# EAGLE design PCB-BI8-2x1 (EAGLE 7.5.0)

## Sheet 1 of 2
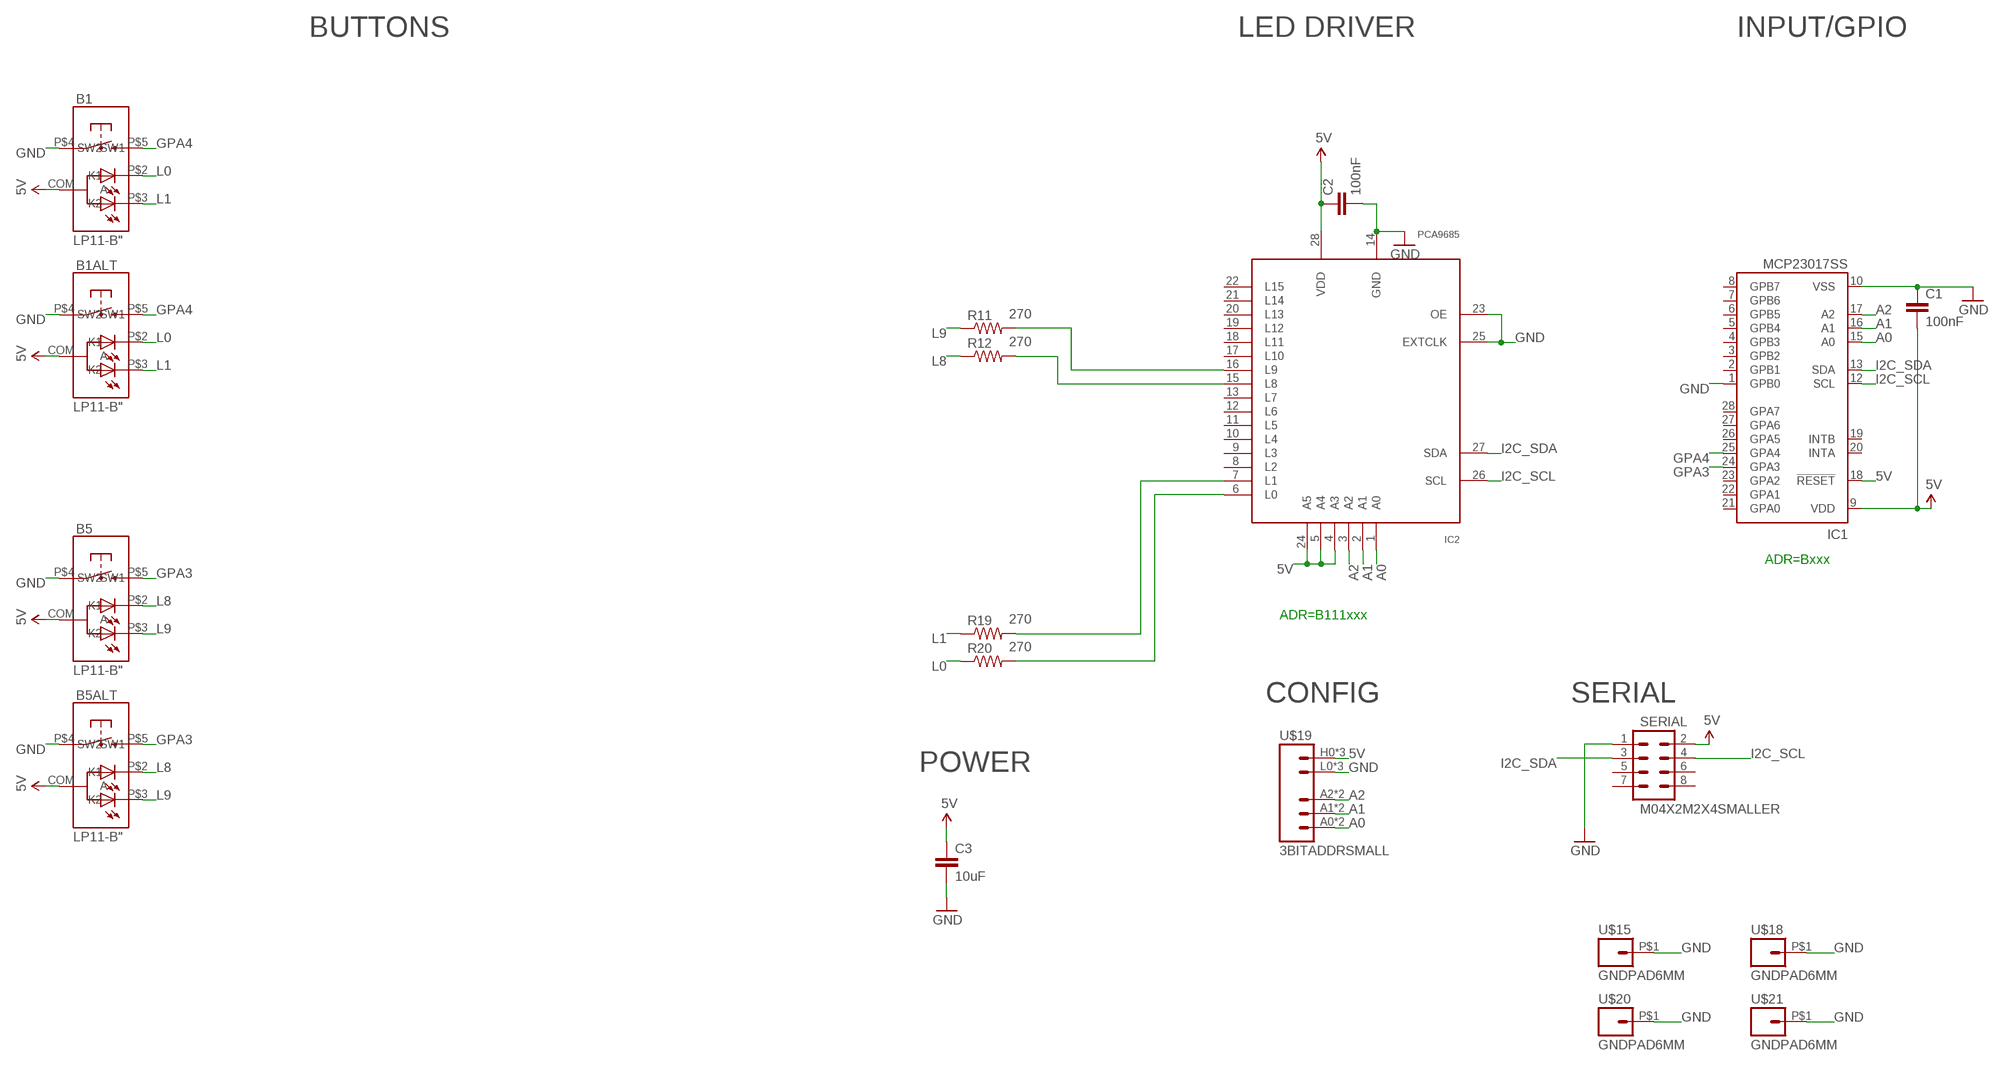
[diagram p0: schematic, sheet 1]

### Parts
B1  LP11-B"  [LP11]
B1ALT  LP11-B"  [LP11]
B5  LP11-B"  [LP11]
B5ALT  LP11-B"  [LP11]
C1  100nF  CAP0603-CAP  [0603-CAP]
C2  100nF  CAP0603-CAP  [0603-CAP]
C3  10uF  CAP0805  [0805]
IC1  MCP23017SS  [SSOP28]
IC2  PCA9685  [TSSOP28]
R11  270  RESISTOR0603-RES  [0603-RES]
R12  270  RESISTOR0603-RES  [0603-RES]
R19  270  RESISTOR0603-RES  [0603-RES]
R20  270  RESISTOR0603-RES  [0603-RES]
SERIAL  M04X2M2X4SMALLER  [M2X4SMALLER]
U$15  GNDPAD6MM  [3.2MMPAD6MM]
U$18  GNDPAD6MM  [3.2MMPAD6MM]
U$19  3BITADDRSMALL  [3BITADDR_SMALL]
U$20  GNDPAD6MM  [3.2MMPAD6MM]
U$21  GNDPAD6MM  [3.2MMPAD6MM]

### Nets
5V [Power]: B1.COM(A) B1ALT.COM(A) B5.COM(A) B5ALT.COM(A) C1.2 C2.1 C3.1 IC1.9(VDD) IC1.18(!RESET) IC2.4(A3) IC2.5(A4) IC2.24(A5) IC2.28(VDD) SERIAL.2 U$19.H0(VCC) U$19.H1(VCC) U$19.H2(VCC)
A0: IC1.15(A0) IC2.1(A0) U$19.A0 U$19.AS0(A0)
A1: IC1.16(A1) IC2.2(A1) U$19.A1 U$19.AS1(A1)
A2: IC1.17(A2) IC2.3(A2) U$19.A2 U$19.AS2(A2)
GND [Power]: B1.P$4(SW1) B1ALT.P$4(SW1) B5.P$4(SW1) B5ALT.P$4(SW1) C1.1 C2.2 C3.2 IC1.1(GPB0) IC1.10(VSS) IC2.14(GND) IC2.23(OE) IC2.25(EXTCLK) SERIAL.1 U$15.P$1 U$18.P$1 U$19.L0(GND) U$19.L1(GND) U$19.L2(GND) U$20.P$1 U$21.P$1
GPA3: B5.P$5(SW2) B5ALT.P$5(SW2) IC1.24(GPA3)
GPA4: B1.P$5(SW2) B1ALT.P$5(SW2) IC1.25(GPA4)
I2C_SCL: IC1.12(SCL) IC2.26(SCL) SERIAL.4
I2C_SDA: IC1.13(SDA) IC2.27(SDA) SERIAL.3
L0: B1.P$2(K1) B1ALT.P$2(K1) R20.1
L1: B1.P$3(K2) B1ALT.P$3(K2) R19.1
L8: B5.P$2(K1) B5ALT.P$2(K1) R12.1
L9: B5.P$3(K2) B5ALT.P$3(K2) R11.1
N$12: IC2.7(L1) R19.2
N$19: IC2.6(L0) R20.2
N$20: IC2.15(L8) R12.2
N$21: IC2.16(L9) R11.2
Unconnected: IC1.2(GPB1) IC1.3(GPB2) IC1.4(GPB3) IC1.5(GPB4) IC1.6(GPB5) IC1.7(GPB6) IC1.8(GPB7) IC1.19(INTB) IC1.20(INTA) IC1.21(GPA0) IC1.22(GPA1) IC1.23(GPA2) IC1.26(GPA5) IC1.27(GPA6) IC1.28(GPA7) IC2.8(L2) IC2.9(L3) IC2.10(L4) IC2.11(L5) IC2.12(L6) IC2.13(L7) IC2.17(L10) IC2.18(L11) IC2.19(L12) IC2.20(L13) IC2.21(L14) IC2.22(L15) SERIAL.5 SERIAL.6 SERIAL.7 SERIAL.8

### Notes on the sheet
- BUTTONS | LED DRIVER | INPUT/GPIO
- ADR=Bxxx
- ADR=B111xxx
- CONFIG | SERIAL
- POWER

## Sheet 2 of 2

## Library data of the parts
B1 B1ALT B5 B5ALT = SKAARHOJ:LP11-B
C1-C3 = SparkFun:CAP: Capacitor Standard 0603 ceramic capacitor, and 0.1" leaded capacitor.
IC1 = microchip:MCP23017: http://ww1.microchip.com/downloads/en/DeviceDoc/21952a.pdf Source: http://ww1.microchip.com/downloads/en/DeviceDoc/21952a.pdf; MF: MICROCHIP; MPN: MCP23017-E/SS; OC_FARNELL: 1467674; OC_NEWARK: 31K2960
IC2 = wsmith:PCA9685
R11 R12 R19 R20 = SparkFun:RESISTOR: Resistor Basic schematic elements and footprints for 0603, 1206, and PTH resistors.
SERIAL = SKAARHOJ:M04X2
U$15 U$18 U$20 U$21 = SKAARHOJ:GNDPAD
U$19 = SKAARHOJ:3BITADDR

## Net classes
0 default: width 0.203 mm, drill 0.406 mm, clearance 0.203 mm
1 Power: width 0.406 mm, drill 0.61 mm, clearance 0.203 mm

## Board
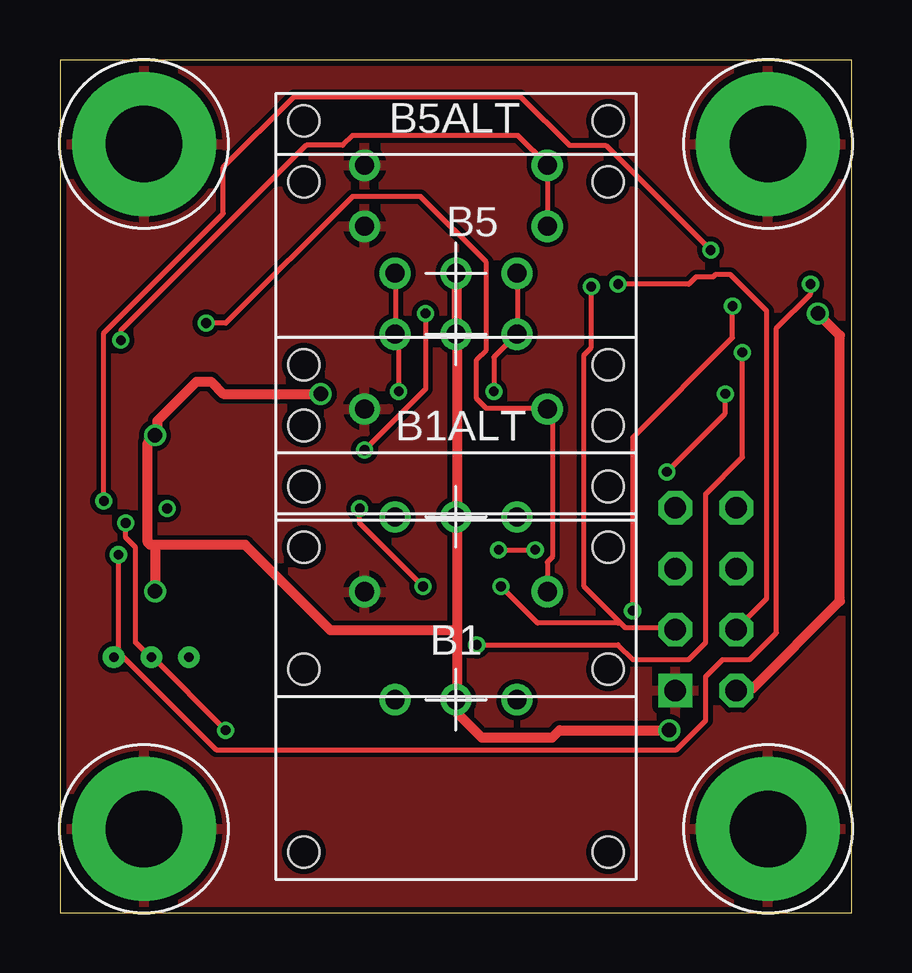
[diagram p1: board, top side]
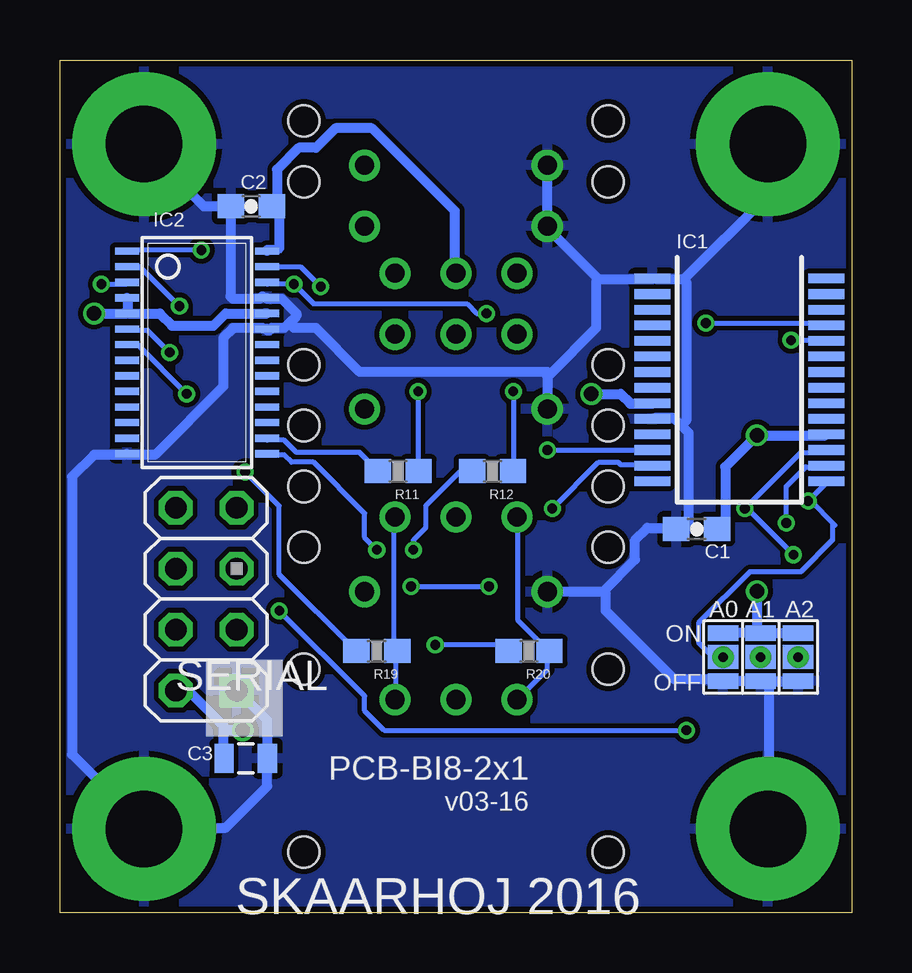
[diagram p2: board, bottom side, seen from below]

Size 33.02 x 35.56 mm. Coordinates in mm from the lower left corner, seen from the top.
Outline: 0,0 33.02,0 33.02,35.56 0,35.56 0,0
Copper layers (1*16): Top 0.035mm / dielectric 1.5mm / Bottom 0.035mm
Design rules "Fusion_eagle_rule_v1.1": minimum track width 6mil, minimum drill 12mil, track to track 6mil, track to pad 6mil, pad to pad 6mil, via to via 6mil, smd to smd 0mil, copper to edge 10mil, drill to drill 10mil, minimum pad ring 10mil, minimum via ring 6mil, stop-mask expansion 2mil, vias tented up to drill 100mil, thermal gap 10mil

### Footprints (pad centres in the part's own frame; a part is rotated, then mirrored left to right if it is on the bottom)
LP11 = drill 0.8: COM 0,0; P$2 0,2.54; P$3 0,-2.54; P$4 4.5,3.81; P$5 4.5,-3.81 | hole 1.3: -6.35,6.35; 6.35,6.35; 6.35,-6.35; -6.35,-6.35
0603-CAP = smd 1.1 x 1: 1 -0.85,0; 2 0.85,0
0805 = smd 0.8 x 1.2: 1 -0.9,0; 2 0.9,0
SSOP28 = smd 0.4 x 1.5: 1 -4.225,-3.625; 2 -3.575,-3.625; 3 -2.925,-3.625; 4 -2.275,-3.625; 5 -1.625,-3.625; 6 -0.975,-3.625; 7 -0.325,-3.625; 8 0.325,-3.625; 9 0.975,-3.625; 10 1.625,-3.625; 11 2.275,-3.625; 12 2.925,-3.625; 13 3.575,-3.625; 14 4.225,-3.625; 15 4.225,3.625; 16 3.575,3.625; 17 2.925,3.625; 18 2.275,3.625; 19 1.625,3.625; 20 0.975,3.625; 21 0.325,3.625; 22 -0.325,3.625; 23 -0.975,3.625; 24 -1.625,3.625; 25 -2.275,3.625; 26 -2.925,3.625; 27 -3.575,3.625; 28 -4.225,3.625
TSSOP28 = smd 0.305 x 0.991: 1 -4.225,-2.918; 2 -3.575,-2.918; 3 -2.925,-2.918; 4 -2.275,-2.918; 5 -1.625,-2.918; 6 -0.975,-2.918; 7 -0.325,-2.918; 8 0.325,-2.918; 9 0.975,-2.918; 10 1.625,-2.918; 11 2.275,-2.918; 12 2.925,-2.918; 13 3.575,-2.918; 14 4.225,-2.918; 15 4.225,2.918; 16 3.575,2.918; 17 2.925,2.918; 18 2.275,2.918; 19 1.625,2.918; 20 0.975,2.918; 21 0.325,2.918; 22 -0.325,2.918; 23 -0.975,2.918; 24 -1.625,2.918; 25 -2.275,2.918; 26 -2.925,2.918; 27 -3.575,2.918; 28 -4.225,2.918
0603-RES = smd 1.1 x 1: 1 -0.85,0; 2 0.85,0
M2X4SMALLER = drill 0.9 square: 1 -1.27,3.81 | drill 0.9 octagon: 2 1.27,3.81; 3 -1.27,1.27; 4 1.27,1.27; 5 -1.27,-1.27; 6 1.27,-1.27; 7 -1.27,-3.81; 8 1.27,-3.81
3.2MMPAD6MM = drill 3.2 pad 6: P$1 0,0
3BITADDR_SMALL = drill 0.4: A0 -1.565,0; A1 0,0; A2 1.565,0 | smd 1.27 x 1: AS0 -1.565,0; AS1 0,0; AS2 1.565,0 | smd 1.27 x 0.635: H0 -1.565,1; H1 0,1; H2 1.565,1; L0 -1.565,-1; L1 0,-1; L2 1.565,-1

### Placement (x,y rotation side)
B1  16.51,8.89 90 top
B1ALT  16.51,16.51 90 top
B5  16.51,24.13 90 top
B5ALT  16.51,26.67 90 top
C1  6.48,16 0 bottom
C2  25.04,29.46 180 bottom
C3  25.27,6.45 0 bottom
IC1  4.7,22.23 270 bottom
IC2  27.3,23.37 270 bottom
R11  18.92,18.41 180 bottom
R12  14.99,18.41 180 bottom
R19  19.81,10.92 180 bottom
R20  13.46,10.92 180 bottom
SERIAL  26.92,13.08 180 bottom
U$15  3.5,3.5 0 top
U$18  29.52,3.5 0 top
U$19  3.81,10.67 0 bottom
U$20  3.5,32.06 0 top
U$21  29.52,32.06 0 top

### Tracks (layer width: path | path; a pad name or v marks a point on that pad's centre or on a via)
5V  (via drill 0.61)
  Top 0.406: v31.6,24.99 32.51,24.08 32.51,13.01 28.85,9.35 28.25,9.35 SERIAL.2 | v10.87,21.64 6.81,21.64 6.3,22.15 5.69,22.15 4.06,20.52 4.06,20.02 v3.96,19.91 3.66,19.61 3.66,15.44 3.76,15.34 3.96,15.34 | 16.56,11.79 16.56,16.36 B1ALT.COM 16.56,16.56 16.56,24.08 B5.COM 16.56,24.28 16.56,26.62 B5ALT.COM | 16.56,11.79 16.56,8.94 B1.COM 16.56,8.74 16.56,8.33 17.58,7.32 20.52,7.32 20.83,7.62 v25.4,7.62 | 16.56,11.79 11.28,11.79 7.72,15.34 3.96,15.34 | 3.96,15.34 v3.96,13.41
  Bottom 0.406: 30.18,24.99 28.85,24.99 28.35,24.49 26.62,24.49 26.11,24.99 24.49,24.99 IC2.24 | 30.18,24.99 IC2.5 30.38,24.99 v31.6,24.99 | 30.18,24.99 30.18,25.6 IC2.4 | 26.21,7.62 26.21,7.82 26.35,7.94 27.62,9.21 SERIAL.2 28.14,9.25 27.64,9.25 | 26.21,7.62 26.21,6.5 C3.1 | IC1.18 1.12,19.91 v3.96,19.91 5.28,18.59 5.28,16.15 C1.2 5.59,16.05 | v10.87,21.64 9.65,21.64 9.25,21.23 8.33,21.23 IC1.9 | IC2.28 24.38,27.64 23.98,27.64 23.88,27.74 23.88,29.46 C2.1 23.98,29.57 23.98,30.99 23.06,31.9 22.35,31.9 21.54,32.72 20.02,32.72 16.56,29.26 16.56,26.72 B5ALT.COM | v25.4,7.62 26.21,7.62 | U$19.H2 2.34,11.68 3.76,11.68 U$19.H1 | U$19.H0 5.28,11.68 3.96,11.68 U$19.H1 | v3.96,13.41 3.96,11.89 U$19.H1
A0  (via drill 0.41)
  Top 0.203: v27.13,27.64 22.76,32 21.23,32 19.2,34.04 9.75,34.04 6.81,31.09 6.81,29.16 1.83,24.18 v1.83,17.17
  Bottom 0.203: v27.13,27.64 30.18,27.64 IC2.1 | IC1.15 1.02,17.98 v1.83,17.17 1.73,17.17 0.76,16.2 | 0.76,16.2 0.71,16.15 | U$19.AS0 5.79,10.67 6.4,11.28 6.4,12.09 4.27,14.22 2.13,14.22 0.81,15.54 0.81,16.15 0.76,16.2
A1  (via drill 0.41)
  Top 0.203: v28.04,25.3 28.04,23.98 23.88,19.81 v23.88,12.6 | v2.74,16.26 2.74,15.65 3.15,15.24 3.15,11.28 3.76,10.67 U$19.AS1 3.86,10.67 v6.91,7.62
  Bottom 0.203: v28.04,25.3 29.67,26.92 30.18,26.92 IC2.2 | v23.88,12.6 20.32,9.04 20.32,8.43 19.51,7.62 v6.91,7.62 | IC1.16 1.12,18.59 1.93,18.59 2.74,17.78 v2.74,16.26 | 3.86,10.67 U$19.AS1
A2  (via drill 0.41)
  Top 0.203: v31.29,26.21 31.29,25.81 29.87,24.38 29.87,11.68 28.75,10.57 27.64,10.57 26.92,9.86 26.92,8.03 25.7,6.81 6.5,6.81 2.64,10.67 2.44,10.67 | 2.44,10.67 U$19.AS2 2.34,10.67 | 2.44,10.67 v2.44,14.94
  Bottom 0.203: v31.29,26.21 30.28,26.21 IC2.3 | IC1.17 1.12,19.2 2.13,19.2 v4.47,16.87 4.37,16.87 v2.44,14.94 | 2.23,10.67 U$19.AS2
GND
  Top 0.406: U$15.P$1 3.66,3.66
  Bottom 0.406: SERIAL.1 25.6,9.25 24.38,8.03 24.38,6.5 C3.2 24.38,6.3 24.38,5.28 26.11,3.56 29.46,3.56 U$18.P$1 29.57,3.66 32.51,6.6 32.51,18.19 31.6,19.1 30.38,19.1 IC2.14 30.18,19.1 29.06,19.1 26.21,21.95 26.21,23.98 25.81,24.38 24.59,24.38 IC2.23 24.38,24.28 24.28,24.28 24.18,24.38 23.67,24.38 23.47,24.59 | 23.47,24.59 23.16,24.89 23.16,24.99 23.77,25.6 24.38,25.6 IC2.25 24.59,25.7 24.69,25.6 25.81,25.6 25.91,25.7 25.91,29.36 C2.2 27.03,29.46 29.57,32 U$21.P$1 | 10.36,13.41 9.04,14.73 9.04,15.54 8.53,16.05 7.42,16.05 C1.1 7.21,16.05 6.91,16.05 6.81,16.15 6.81,20.02 7.11,20.32 | 10.36,13.41 12.7,13.41 B1.P$4 | 7.11,20.32 7.42,20.62 8.23,20.62 IC1.10 | 10.57,26.42 8.33,26.42 IC1.1 8.13,26.42 7.01,26.42 | 10.57,26.42 12.7,28.55 B5.P$4 B5ALT.P$4 | B1ALT.P$4 12.7,22.35 12.6,22.45 | 12.6,22.45 10.67,24.38 10.67,26.31 10.57,26.42 | 7.01,26.42 6.91,26.31 6.91,20.52 7.11,20.32 | 10.36,13.41 10.26,13.31 10.26,12.6 7.42,9.75 5.49,9.75 U$19.L0 5.28,9.65 3.96,9.65 U$19.L1 | 7.01,26.42 3.56,29.87 3.56,32 U$20.P$1 | 23.47,24.59 23.27,24.38 22.35,24.38 20.52,22.55 12.7,22.55 12.6,22.45 | U$19.L2 2.34,9.65 3.76,9.65 U$19.L1 | U$19.L1 3.45,9.55 3.45,3.56 U$15.P$1
  pour Top: 0,0 33.02,0 33.02,35.56 0,35.56
  pour Bottom: 0,0 33.02,0 33.02,35.56 0,35.56
GPA3  (via drill 0.41)
  Top 0.203: v2.54,23.88 2.54,24.28 10.26,32 11.79,32 12.19,32.41 19.1,32.41 20.32,31.19 B5ALT.P$5 B5.P$5
  Bottom 0.203: v2.54,23.88 1.12,23.88 IC1.24
GPA4  (via drill 0.41)
  Top 0.203: v6.1,24.59 6.91,24.59 12.19,29.87 15.04,29.87 17.78,27.13 17.78,23.47 17.37,23.06 17.37,21.44 17.78,21.03 20.32,21.03 B1ALT.P$5 20.32,20.93 20.52,20.73 20.52,14.83 20.32,14.63 B1.P$5
  Bottom 0.203: v6.1,24.59 1.12,24.59 IC1.25
I2C_SCL  (via drill 0.41)
  Top 0.203: v23.27,26.21 26.21,26.21 26.52,26.52 27.23,26.52 27.33,26.62 27.94,26.62 29.46,25.09 29.46,13.11 28.25,11.89 SERIAL.4 | v12.7,19.3 15.24,21.84 v15.24,24.99
  Bottom 0.203: IC2.26 24.38,26.21 v23.27,26.21 22.45,25.4 16.05,25.4 15.65,24.99 v15.24,24.99 | v12.7,19.3 IC1.12
I2C_SDA  (via drill 0.41)
  Top 0.203: v22.15,26.11 22.15,23.57 21.84,23.27 21.84,13.61 23.32,12.14 | 23.32,12.14 23.57,11.89 25.6,11.89 SERIAL.3 | v12.5,16.87 12.5,16.26 v15.14,13.61 | v18.39,13.61 19.91,12.09 23.27,12.09 23.32,12.14
  Bottom 0.203: v22.15,26.11 22.96,26.92 24.38,26.92 IC2.27 | v12.5,16.87 10.57,18.8 9.75,18.8 9.65,18.69 8.33,18.69 IC1.13 | v18.39,13.61 v15.14,13.61
L0
  Bottom 0.203: B1.P$2 12.7,10.16 12.7,10.87 R20.1 12.7,10.97 13.92,12.19 13.92,16.46 B1ALT.P$2
L1
  Bottom 0.203: B1.P$3 19,8.94 19,10.87 R19.1 19.1,10.87 19.1,16.46 B1ALT.P$3
L8  (via drill 0.41)
  Top 0.203: v14.12,21.74 14.12,23.98 B5.P$2 14.02,24.18 14.02,26.62 B5ALT.P$2
  Bottom 0.203: v14.12,21.74 14.12,18.49 R12.1
L9  (via drill 0.41)
  Top 0.203: v18.09,21.74 18.09,23.16 B5.P$3 19.1,24.18 19.1,26.62 B5ALT.P$3
  Bottom 0.203: v18.09,21.74 18.09,18.49 R11.1
N$12  (via drill 0.41)
  Top 0.203: v27.74,21.64 27.74,20.83 v25.3,18.39
  Bottom 0.203: v27.74,21.64 29.77,23.67 30.18,23.67 IC2.7 | v25.3,18.39 23.88,16.97 23.88,14.12 20.73,10.97 R19.2
N$19  (via drill 0.41)
  Top 0.203: v28.45,23.37 28.45,19 26.92,17.48 26.92,11.28 26.21,10.57 23.88,10.57 23.27,11.18 v17.37,11.18
  Bottom 0.203: v28.45,23.37 29.36,24.28 30.18,24.28 IC2.6 | v17.37,11.18 14.53,11.18 14.33,10.97 R20.2
N$20  (via drill 0.41)
  Top 0.203: v18.29,15.14 v19.81,15.14
  Bottom 0.203: v19.81,15.14 20.32,15.65 20.32,16.66 22.45,18.8 23.37,18.8 23.67,19.1 24.38,19.1 IC2.15 | v18.29,15.14 18.29,15.54 17.78,16.05 17.78,16.97 16.36,18.39 15.85,18.39 R12.2
N$21
  Bottom 0.203: IC2.16 24.38,19.71 23.67,19.71 23.16,19.2 20.52,19.2 19.81,18.49 R11.2

### Text on the board
_bsilk: PCB-BI8-2x1 | v03-16 | SKAARHOJ 2016